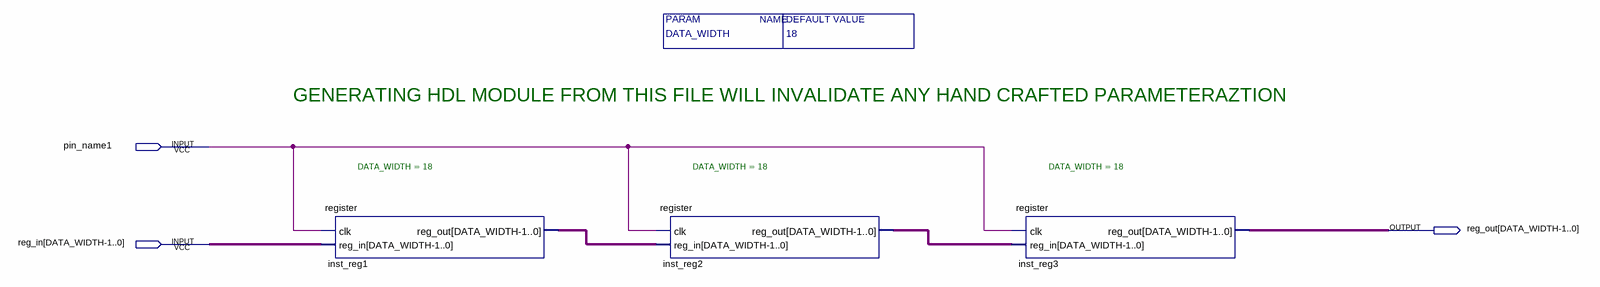
[diagram p0: schematic sheet]
// Quartus schematic reg_delay_3L.bdf as structural Verilog: 3 symbols, 3 pins
module reg_delay_3L #(parameter DATA_WIDTH = 18) (
  input  pin_name1,
  input  [17:0] reg_in,
  output [17:0] reg_out
);

  wire [17:0] inst_reg1_reg_out, inst_reg2_reg_out;

  register #(.DATA_WIDTH(18)) inst_reg1 (.clk(pin_name1), .reg_in(reg_in), .reg_out(inst_reg1_reg_out));
  register #(.DATA_WIDTH(18)) inst_reg2 (.clk(pin_name1), .reg_in(inst_reg1_reg_out), .reg_out(inst_reg2_reg_out));
  register #(.DATA_WIDTH(18)) inst_reg3 (.clk(pin_name1), .reg_in(inst_reg2_reg_out), .reg_out(reg_out));

  // Notes on the sheet:
  //   GENERATING HDL MODULE FROM THIS FILE WILL INVALIDATE ANY HAND CRAFTED PARAMETERAZTION
endmodule
